# Altium project HighVoltageProbe_v1.0.PrjPcb
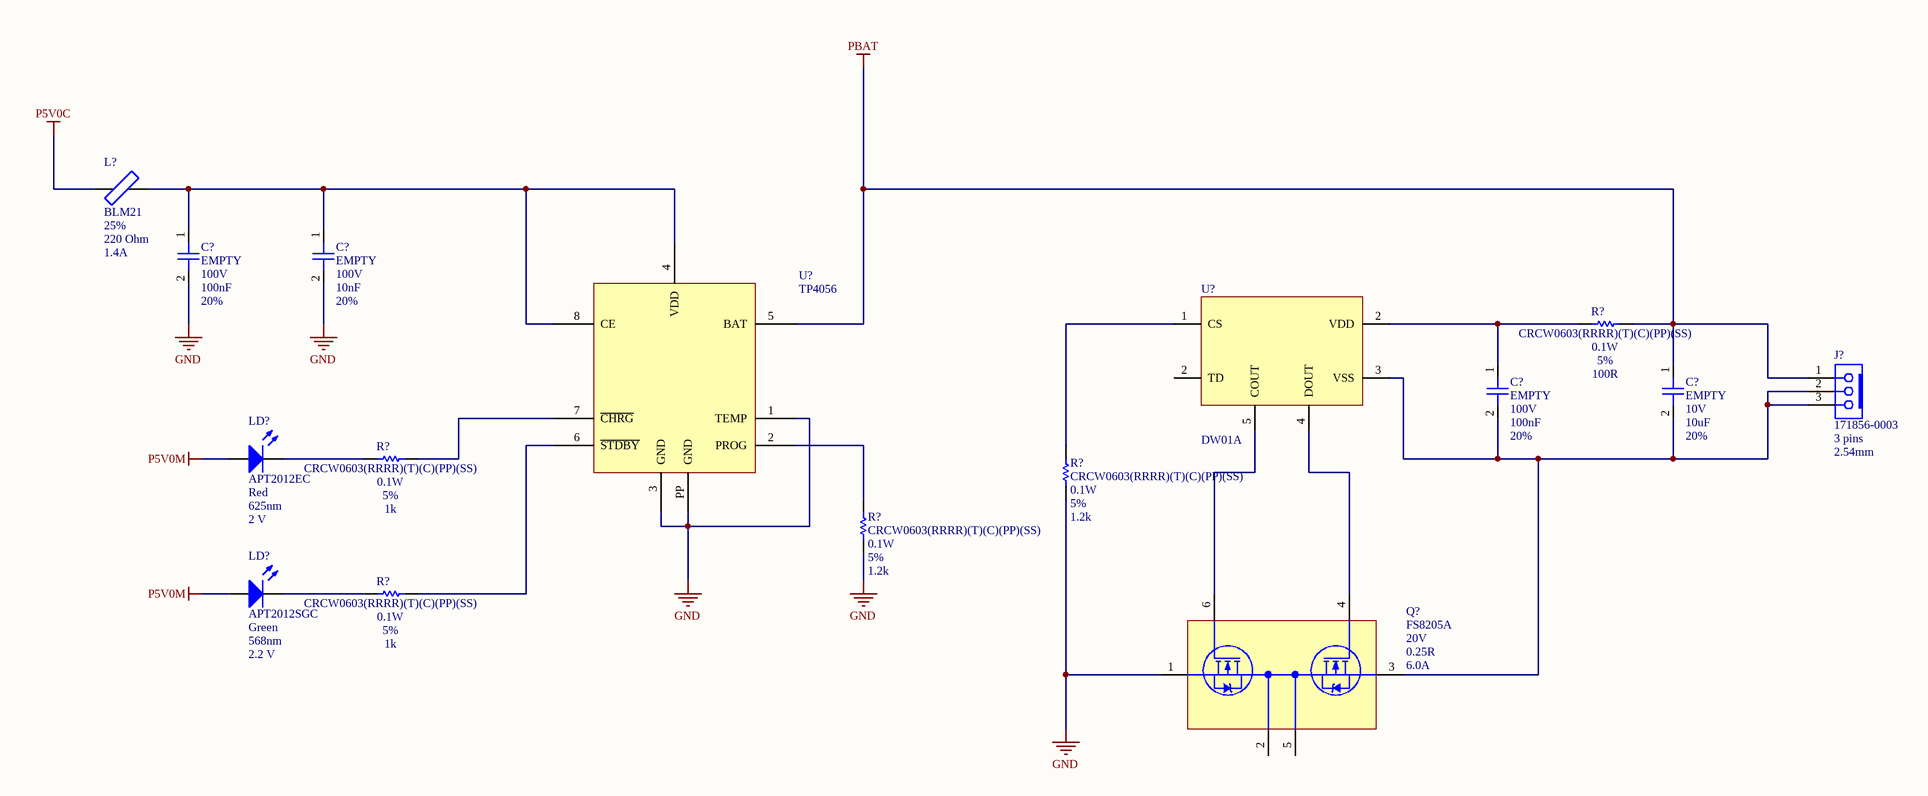
[diagram p0: HVP_BatteryCharger_v1.0.SchDoc]
7 sheets, 154 parts. Net scope: global (net labels, ports and power ports of the same name join across sheets).
Board file: HVP_PCB_v1.0.PcbDoc
Sheets:
  HVP_Title_v1.0.SchDoc
  HVP_BatteryCharger_v1.0.SchDoc
  HVP_PowerSupply_v1.0.SchDoc
  HVP_PowerSupplyOpAmp_v1.0.SchDoc
  HVP_InputDivisor_v1.0.SchDoc
  HVP_Amplifier_v1.0.SchDoc
  HVP_DiffAmplifier_v1.0.SchDoc

## Sheet HVP_Title_v1.0.SchDoc
size A3; Organization: SEW EURODRIVE; Address1: Jose Rubim Rd.; Address2: Santos Dumont Rd.; Address3: 205; Address4: Indaiatuba/SP; Revision: 0.0; Address5: Brazil

### Notes on the sheet
- Rev.
- Description
- Date
- Author
- Page
- Schematic Page
- 1.0
- Project kickoff
- 1
- Title page
- Title
- Checked By
- Size:
- Revision:
- A3
- Date:
- Project
- Time:
- Sheet
- of
- File:

## Sheet HVP_BatteryCharger_v1.0.SchDoc
size A3; Organization: SEW EURODRIVE; Address1: Jose Rubim Rd.; Address2: Santos Dumont Rd.; Address3: 205; Address4: Indaiatuba/SP; Address5: Brazil

### Parts
(Parts that share a designator on the sheet are numbered #1, #2 ... from top to bottom, then left to right.)
C?#1  value 100nF  PartNumber1: EMPTY  Voltage: 100V  Tolerance: 20%  [CAP0603]  (hidden comment: CC0603)
C?#2  value 10nF  PartNumber1: EMPTY  Voltage: 100V  Tolerance: 20%  [CAP0603]  (hidden comment: CC0603)
C?#3  value 100nF  PartNumber1: EMPTY  Voltage: 100V  Tolerance: 20%  [CAP0603]  (hidden comment: CC0603)
C?#4  value 10uF  PartNumber1: EMPTY  Voltage: 10V  Tolerance: 20%  [CAP0805]  (hidden comment: CC0805)
J?#1  Pins: 3 pins  Pitch: 2.54mm  [CONKK03STRMALE_100_100]  (hidden comment: 171856-0003)
L?#1  value 220 Ohm  Tolerance: 25%  Current: 1.4A  [IND0805]  (hidden comment: BLM21)
LD?#1  Colour: Red  Wavelength: 625nm  Vled: 2 V  [LED0805]  (hidden comment: APT2012EC)
LD?#2  Colour: Green  Wavelength: 568nm  Vled: 2.2 V  [LED0805]  (hidden comment: APT2012SGC)
Q?  Vdds: 20V  Rds(on): 0.25R  Id: 6.0A  [TSOT23-6]  (hidden comment: FS8205A)
R?#1  value 100R  PartNumber1: CRCW0603(RRRR)(T)(C)(PP)(SS)  Power: 0.1W  Tolerance: 5%  [RES0603]  (hidden comment: Chip Resistor)
R?#2  value 1k  PartNumber1: CRCW0603(RRRR)(T)(C)(PP)(SS)  Power: 0.1W  Tolerance: 5%  [RES0603]  (hidden comment: Chip Resistor)
R?#3  value 1.2k  PartNumber1: CRCW0603(RRRR)(T)(C)(PP)(SS)  Power: 0.1W  Tolerance: 5%  [RES0603]  (hidden comment: Chip Resistor)
R?#4  value 1.2k  PartNumber1: CRCW0603(RRRR)(T)(C)(PP)(SS)  Power: 0.1W  Tolerance: 5%  [RES0603]  (hidden comment: Chip Resistor)
R?#5  value 1k  PartNumber1: CRCW0603(RRRR)(T)(C)(PP)(SS)  Power: 0.1W  Tolerance: 5%  [RES0603]  (hidden comment: Chip Resistor)
U?#1  DW01A  [SOT23-6]
U?#2  TP4056  [SOIC-8P-3.9mm]

### Nets
GND: C?#1.2 C?#2.2 Q?.1(S1) R?#3.1 R?#4.1 U?#2.1(TEMP) U?#2.3(GND) U?#2.PP(GND)
P5V0C: L?#1.1
P5V0M: LD?#1.A LD?#2.A
PBAT: C?#4.1 J?#1.1 R?#1.1 U?#2.5(BAT)
NetC?#1_1: C?#1.1 C?#2.1 L?#1.2 U?#2.4(VDD) U?#2.8(CE)
NetC?#3_1: C?#3.1 R?#1.2 U?#1.2(VDD)
NetC?#3_2: C?#3.2 C?#4.2 J?#1.2 J?#1.3 Q?.3(S2) U?#1.3(VSS)
NetLD?#1_K: LD?#1.K R?#2.1
NetLD?#2_K: LD?#2.K R?#5.1
NetQ?_4: Q?.4(G2) U?#1.4(DOUT)
NetQ?_6: Q?.6(G1) U?#1.5(COUT)
NetR?#2_2: R?#2.2 U?#2.7(~{CHRG})
NetR?#3_2: R?#3.2 U?#1.1(CS)
NetR?#4_2: R?#4.2 U?#2.2(PROG)
NetR?#5_2: R?#5.2 U?#2.6(~{STDBY})

Not connected (* = marked no-connect by the designer): Q? 2(D1/D2) 5(D1/D2)

### Notes on the sheet
- Title
- Author
- Checked By
- Size:
- Revision:
- A3
- Date:
- Project
- Time:
- Sheet
- of
- File:

### Library data of the parts
C?#1-C?#3 = CC0603: Surface Mount Multilayer Ceramic Chip Capacitors  for Commercial Applications; Manufacter1: Yageo; Published: 19-Jun-2016; LatestRevisionDate: 19-Jun-2016; Publisher: Lucas Moraes; PackageReference: CAP0603; PackageDescription: CAP0603;2 Leads
C?#4 = CC0805: Surface Mount Multilayer Ceramic Chip Capacitors  for Commercial Applications; Manufacter1: Yageo; Published: 19-Jun-2016; LatestRevisionDate: 19-Jun-2016; Publisher: Lucas Moraes; PackageReference: CAP0805; PackageDescription: CAP0805;2 Leads
J?#1 = 171856-0003: Headers & Wire Housings KK RPC 100 Hdr FrLk Vert 03; Manufacter1: Molex; LastRevisionNote: Created; Gender: Male; Direction: 180; Published: 20-Dec-2022; LatestRevisionDate: 20-Dec-2022; PackageReference: CONKK03STRMALE_100_100; Publisher: Lucas Moraes; PackageDescription: CONKK03STRMALE_100_100; 3 Leads; Type: Pin; Datasheet: https://www.molex.com/pdm_docs/sd/1718563003_sd.pdf; PartNumber1: 171856-0003
L?#1 = BLM21: Ferrite Beads 0805; Manufacter1: Murata Electronics; LatestRevisionDate: 05-Apr-2023; PackageReference: IND0805; Publisher: Lucas Moraes; PackageDescription: IND0805; 2 Leads; Published: 05-Apr-2023; Datasheet: https://br.mouser.com/datasheet/2/281/ENFA0005-1915781.pdf; Code: *; PartNumber1: BLM21
LD?#1 = APT2012EC: Standard LEDs - SMD 0805 Red; Manufacter1: Kingbright; LastRevisionNote: Created; Published: 29-Dec-2016; PackageReference: LED0805; Publisher: Lucas Moraes; PackageDescription: LED0805; 2 leads; LastRevision: 29-Dec-2016; Datasheet: http://www.us.kingbright.com/images/catalog/SPEC/APT2012EC.pdf; PartNumber1: APT2012EC
LD?#2 = APT2012SGC: Standard LEDs - SMD 0805 Green; Manufacter1: Kingbright; LastRevisionNote: Created; Published: 29-Dec-2016; PackageReference: LED0805; Publisher: Lucas Moraes; PackageDescription: LED0805; 2 leads; LastRevision: 29-Dec-2016; Datasheet: http://www.us.kingbright.com/images/catalog/SPEC/APT2012SGC.pdf; PartNumber1: APT2012SGC
Q? = FS8205A: MOSFET DUAL N-CHANNEL; Manufacter1: Diodes Incorporated; Published: 21-Mar-2023; LatestRevisionDate: 21-Mar-2023; LatestRevisionNote: Created; Publisher: Lucas Moraes; PackageDescription: TSOT23-6; 6 Leads; PackageReference: TSOT23-6; PartNumber1: FS8205A
R?#1-R?#5 = CRCW0603: Thick Film Chip Resistors with CECC Approval,  available with Established Reliability; Manufacter1: Vishay; LatestRevisionDate: 06-May-2016; PackageReference: 0603; Publisher: Lucas Moraes; PackageDescription: SMD 0603; 2 Leads; Published: 06-May-2016
U?#1 = DW01A: Battery Protection IC SOT-23-6; Manufacter1: H&M semi; Published: 20-Jul-2022; LatestRevisionDate: 20-Jul-2022; LatestRevisionNote: Created; PackageReference: SOT-26; Publisher: Lucas Moraes; PackageDescription: SOT-26;6 Leads; Datasheet: https://hmsemi.com/downfile/DW01A.PDF; PartNumber1: DW01A
U?#2 = TP4056: 1A Standalone Linear Li-lon Battery Charger with Thermal Regulation in SOP-8; Manufacter1: NanJing Top Power ASIC Corp; Published: 20-Jul-2022; LatestRevisionDate: 20-Jul-2022; LatestRevisionNote: Created; PackageReference: SOIC-8-3.9mm; Publisher: Lucas Moraes; PackageDescription: SOIC-8-3.9mm;8 Leads; PartNumber1: TP4056

## Sheet HVP_PowerSupply_v1.0.SchDoc
size A3; Organization: SEW EURODRIVE; Address1: Jose Rubim Rd.; Address2: Santos Dumont Rd.; Address3: 205; Address4: Indaiatuba/SP; Address5: Brazil
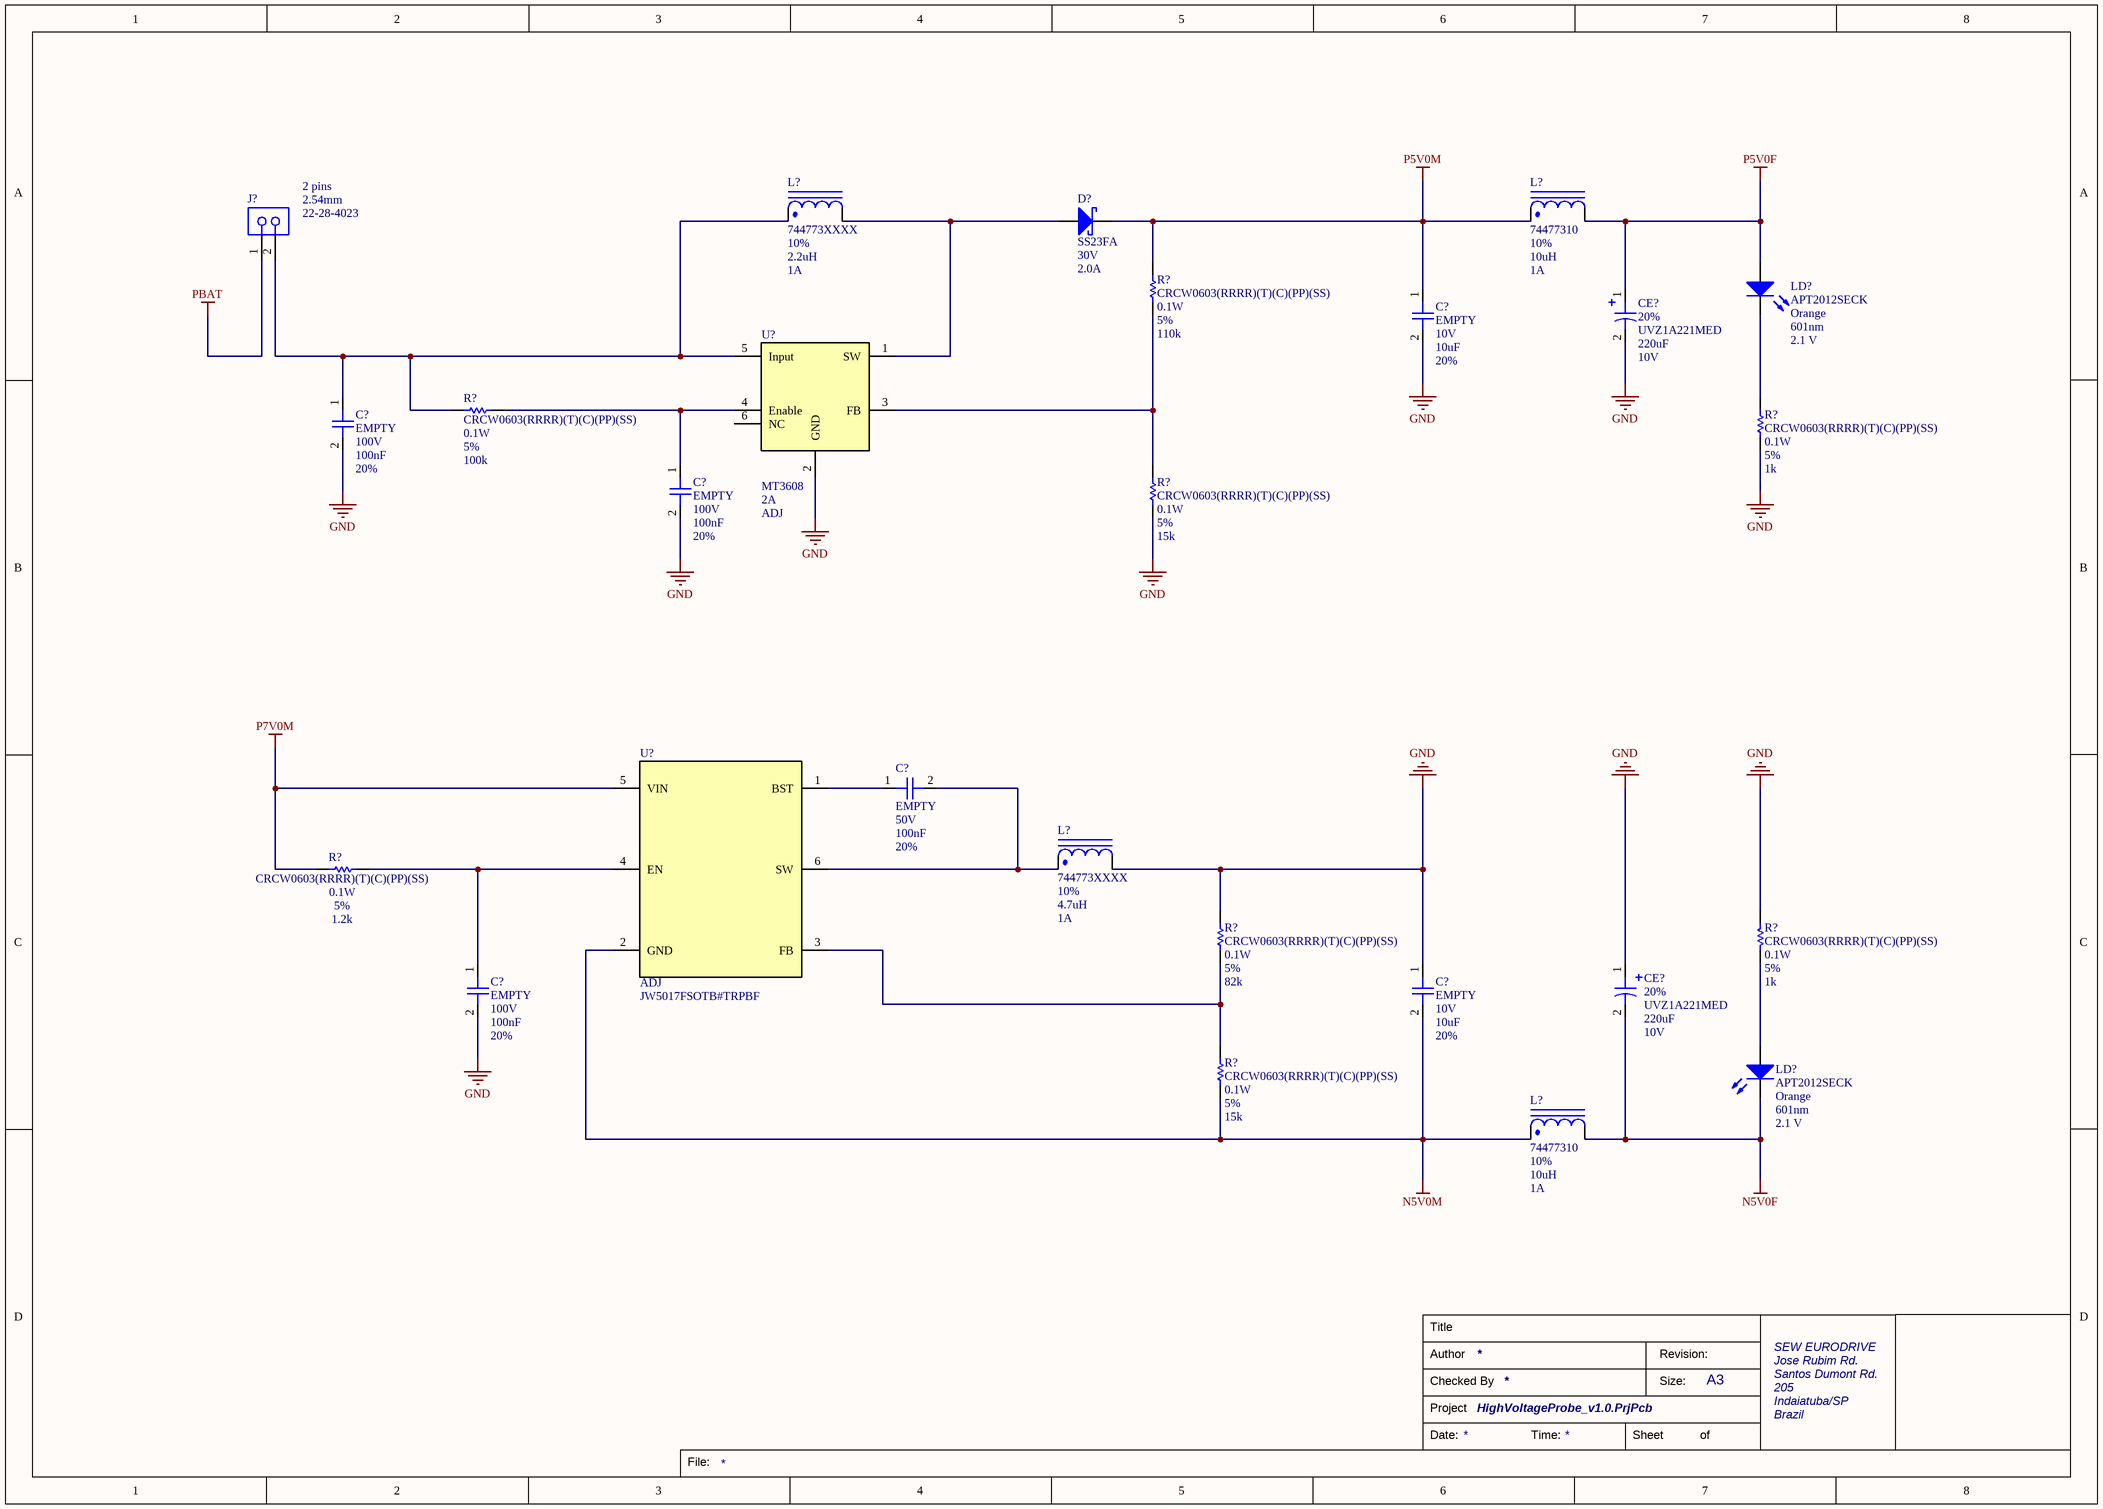
[diagram p1: HVP_PowerSupply_v1.0.SchDoc]

### Parts
(Parts that share a designator on the sheet are numbered #1, #2 ... from top to bottom, then left to right.)
C?#5  value 10uF  PartNumber1: EMPTY  Voltage: 10V  Tolerance: 20%  [CAP0805]  (hidden comment: CC0805)
C?#6  value 100nF  PartNumber1: EMPTY  Voltage: 100V  Tolerance: 20%  [CAP0603]  (hidden comment: CC0603)
C?#7  value 100nF  PartNumber1: EMPTY  Voltage: 100V  Tolerance: 20%  [CAP0603]  (hidden comment: CC0603)
C?#8  value 100nF  PartNumber1: EMPTY  Voltage: 50V  Tolerance: 20%  [CAP0603]  (hidden comment: CC0603)
C?#9  value 100nF  PartNumber1: EMPTY  Voltage: 100V  Tolerance: 20%  [CAP0603]  (hidden comment: CC0603)
C?#10  value 10uF  PartNumber1: EMPTY  Voltage: 10V  Tolerance: 20%  [CAP0805]  (hidden comment: CC0805)
CE?#1  value 220uF  Tolerance: 20%  PartNumber1: UVZ1A221MED  Voltage: 10V  [2.5-6.3-11.0]  (hidden comment: 10V 220uF)
CE?#2  value 220uF  Tolerance: 20%  PartNumber1: UVZ1A221MED  Voltage: 10V  [2.5-6.3-11.0]  (hidden comment: 10V 220uF)
D?#1  Vrrm: 30V  If: 2.0A  [SOD-123FA]  (hidden comment: SS23FA)
J?#2  Pins: 2 pins  Pitch: 2.54mm  [CONSIL02STRMALE_100_100]  (hidden comment: 22-28-4023)
L?#2  value 2.2uH  PartNumber1: 744773XXXX  Tolerance: 10%  Current: 1A  [WE-PD2-4532]  (hidden comment: WE-PD2 4532)
L?#3  value 10uH  PartNumber1: 74477310  Tolerance: 10%  Current: 1A  [WE-PD2-4532]  (hidden comment: WE-PD2 4532)
L?#4  value 4.7uH  PartNumber1: 744773XXXX  Tolerance: 10%  Current: 1A  [WE-PD2-4532]  (hidden comment: WE-PD2 4532)
L?#5  value 10uH  PartNumber1: 74477310  Tolerance: 10%  Current: 1A  [WE-PD2-4532]  (hidden comment: WE-PD2 4532)
LD?#3  Colour: Orange  Wavelength: 601nm  Vled: 2.1 V  [LED0805]  (hidden comment: APT2012SECK)
LD?#4  Colour: Orange  Wavelength: 601nm  Vled: 2.1 V  [LED0805]  (hidden comment: APT2012SECK)
R?#6  value 110k  PartNumber1: CRCW0603(RRRR)(T)(C)(PP)(SS)  Power: 0.1W  Tolerance: 5%  [RES0603]  (hidden comment: Chip Resistor)
R?#7  value 100k  PartNumber1: CRCW0603(RRRR)(T)(C)(PP)(SS)  Power: 0.1W  Tolerance: 5%  [RES0603]  (hidden comment: Chip Resistor)
R?#8  value 1k  PartNumber1: CRCW0603(RRRR)(T)(C)(PP)(SS)  Power: 0.1W  Tolerance: 5%  [RES0603]  (hidden comment: Chip Resistor)
R?#9  value 15k  PartNumber1: CRCW0603(RRRR)(T)(C)(PP)(SS)  Power: 0.1W  Tolerance: 5%  [RES0603]  (hidden comment: Chip Resistor)
R?#10  value 1.2k  PartNumber1: CRCW0603(RRRR)(T)(C)(PP)(SS)  Power: 0.1W  Tolerance: 5%  [RES0603]  (hidden comment: Chip Resistor)
R?#11  value 82k  PartNumber1: CRCW0603(RRRR)(T)(C)(PP)(SS)  Power: 0.1W  Tolerance: 5%  [RES0603]  (hidden comment: Chip Resistor)
R?#12  value 1k  PartNumber1: CRCW0603(RRRR)(T)(C)(PP)(SS)  Power: 0.1W  Tolerance: 5%  [RES0603]  (hidden comment: Chip Resistor)
R?#13  value 15k  PartNumber1: CRCW0603(RRRR)(T)(C)(PP)(SS)  Power: 0.1W  Tolerance: 5%  [RES0603]  (hidden comment: Chip Resistor)
U?#3  Current: 2A  Voltage: ADJ  [SOT23-6]  (hidden comment: MT3608)
U?#4  Voltage: ADJ  PartNumber1: JW5017FSOTB#TRPBF  [SOT23-6]  (hidden comment: JW5017F)

### Nets
GND: C?#5.2 C?#6.2 C?#7.2 C?#9.2 C?#10.1 CE?#1.2 CE?#2.1 L?#4.2 R?#8.2 R?#9.1 R?#11.2 R?#12.2 U?#3.2(GND)
N5V0F: CE?#2.2 L?#5.2 LD?#4.K
N5V0M: C?#10.2 L?#5.1 R?#13.1 U?#4.2(GND)
P5V0F: CE?#1.1 L?#3.2 LD?#3.A
P5V0M: C?#5.1 D?#1.K L?#3.1 R?#6.2
P7V0M: R?#10.2 U?#4.5(VIN)
PBAT: J?#2.1
NetC?#6_1: C?#6.1 J?#2.2 L?#2.1 R?#7.2 U?#3.5(Input)
NetC?#7_1: C?#7.1 R?#7.1 U?#3.4(Enable)
NetC?#8_1: C?#8.1 U?#4.1(BST)
NetC?#8_2: C?#8.2 L?#4.1 U?#4.6(SW)
NetC?#9_1: C?#9.1 R?#10.1 U?#4.4(EN)
NetD?#1_A: D?#1.A L?#2.2 U?#3.1(SW)
NetLD?#3_K: LD?#3.K R?#8.1
NetLD?#4_A: LD?#4.A R?#12.1
NetR?#6_1: R?#6.1 R?#9.2 U?#3.3(FB)
NetR?#11_1: R?#11.1 R?#13.2 U?#4.3(FB)

Not connected (* = marked no-connect by the designer): U?#3 6(NC)

### Notes on the sheet
- Title
- Author
- Checked By
- Size:
- Revision:
- A3
- Date:
- Project
- Time:
- Sheet
- of
- File:

### Library data of the parts
C?#5 C?#10 = CC0805: as C?#4 on sheet HVP_BatteryCharger_v1.0; Published: 19-Jun-2016; LatestRevisionDate: 19-Jun-2016; Publisher: Lucas Moraes; PackageReference: CAP0805; PackageDescription: CAP0805;2 Leads
C?#6-C?#9 = CC0603: as C?#1 on sheet HVP_BatteryCharger_v1.0; Published: 19-Jun-2016; LatestRevisionDate: 19-Jun-2016; Publisher: Lucas Moraes; PackageReference: CAP0603; PackageDescription: CAP0603;2 Leads
CE?#1 CE?#2 = 10V 220uF: Electrolytic Capacitor PTH; Manufacter1: Nichicon; Code: 221; Published: 26-Dec-2016; LatestRevisionDate: 26-Dec-2016; PackageReference: 2.5-6.3; Publisher: Lucas Moraes; PackageDescription: 2.5-6.3;2 leads; LatestRevisionNote: Created
D?#1 = SS23FA: HIGH EFFICIENCY FAST RECOVERY RECTIFIER DIODE; Manufacter1: Fairchild; Vf: 0.50V; Published: 29-Jun-2016; LatestRevisionDate: 29-Jun-2016; PackageReference: SOD-123FA; Publisher: Lucas Moraes; PackageDescription: SOD-123FA; 2 Leads; PartNumber1: SS23FA
J?#2 = 22-28-4023: Headers & Wire Housings 02 MODII HDR SRST B/A .100CL; Manufacter1: Molex; LastRevisionNote: Created; Gender: Male; Published: 15-Set-2017; LatestRevisionDate: 27-Mar-2023; PackageReference: CONSIL02STRMALE_100_100; Publisher: Lucas Moraes; PackageDescription: CONSIL02STRMALE_100_100; 2 Leads; Type: Pin; PartNumber1: 22-28-4023
L?#2-L?#5 = WE-PD2 4532: Fixed Inductors WE-PD2 4532; Manufacter1: Wurth Elektronik; LatestRevisionDate: 22-Mar-2022; PackageReference: WE-PD2 4532; Publisher: Lucas Moraes; PackageDescription: WE-PD2 4532; 2 Leads; Published: 22-Mar-2022; Datasheet: https://www.we-online.com/catalog/en/WE-PD2
LD?#3 LD?#4 = APT2012SECK: Standard LEDs - SMD 0805 Orange; Manufacter1: Kingbright; LastRevisionNote: Created; Published: 29-Dec-2016; PackageReference: LED0805; Publisher: Lucas Moraes; PackageDescription: LED0805; 2 leads; LastRevision: 29-Dec-2016; Datasheet: http://www.mouser.com/ds/2/216/APT2012SECK-230997.pdf; PartNumber1: APT2012SECK
R?#6-R?#13 = CRCW0603: as R?#1 on sheet HVP_BatteryCharger_v1.0; LatestRevisionDate: 06-May-2016; PackageReference: 0603; Publisher: Lucas Moraes; PackageDescription: SMD 0603; 2 Leads; Published: 06-May-2016
U?#3 = MT3608: High Efficiency 1.2MHz 2A Step Up Converter; Manufacter1: AEROSEMI; Published: 22-Dec-2019; LatestRevisionDate: 22-Dec-2019; LatestRevisionNote: Created; PackageReference: SOT-23-6; Publisher: Lucas Moraes; PackageDescription: SOT-23-6;6 Leads; PartNumber2: *; Manufacter2: *; Manufacter3: *; PartNumber3: *; PartNumber1: MT3608
U?#4 = JW5017F: 1.2A, 26V Synchronous Step-Down Converter; Manufacter1: JOULWATT; Current: 1.2A; LatestRevisionDate: 08-Jan-2022; LatestRevisionNote: Created; PackageDescription: SOT-23-6;6 Leads; PackageReference: SOT-23-6; Published: 08-Jan-2022; Publisher: Lucas Moraes

## Sheet HVP_PowerSupplyOpAmp_v1.0.SchDoc
size A3; Organization: SEW EURODRIVE; Address1: Jose Rubim Rd.; Address2: Santos Dumont Rd.; Address3: 205; Address4: Indaiatuba/SP; Address5: Brazil
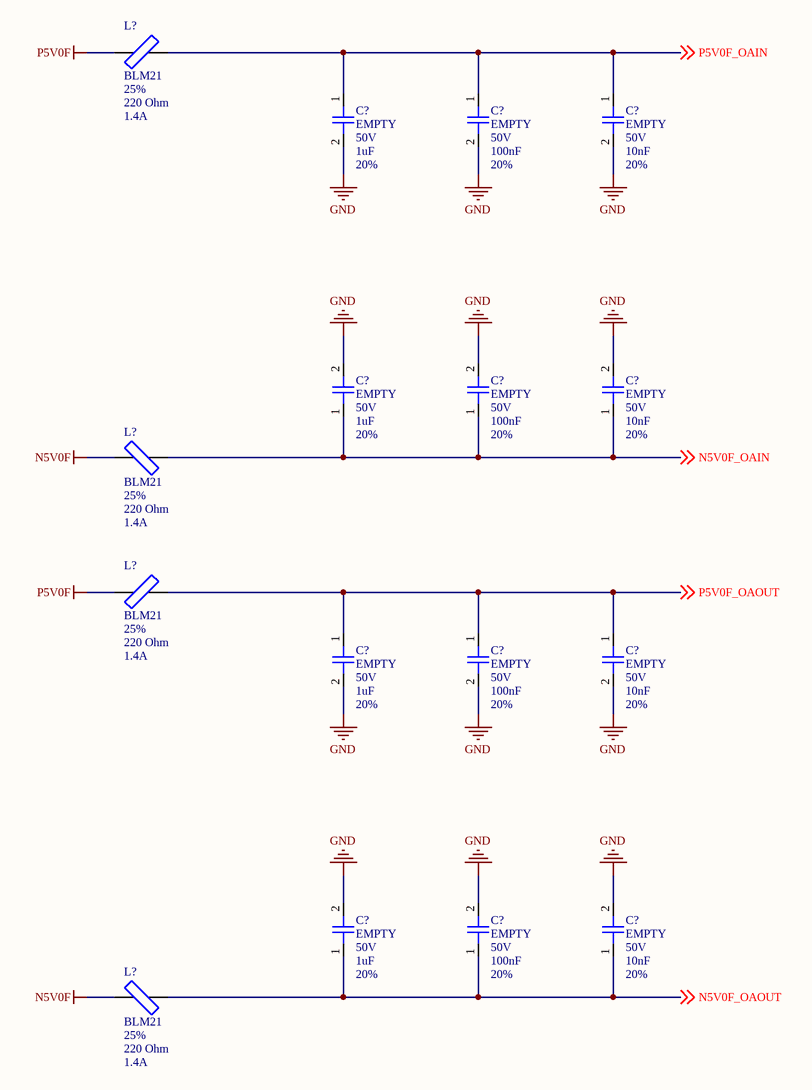
[diagram p2: HVP_PowerSupplyOpAmp_v1.0.SchDoc]

### Parts
(Parts that share a designator on the sheet are numbered #1, #2 ... from top to bottom, then left to right.)
C?#11  value 1uF  PartNumber1: EMPTY  Voltage: 50V  Tolerance: 20%  [CAP0603]  (hidden comment: CC0603)
C?#12  value 100nF  PartNumber1: EMPTY  Voltage: 50V  Tolerance: 20%  [CAP0603]  (hidden comment: CC0603)
C?#13  value 10nF  PartNumber1: EMPTY  Voltage: 50V  Tolerance: 20%  [CAP0603]  (hidden comment: CC0603)
C?#14  value 1uF  PartNumber1: EMPTY  Voltage: 50V  Tolerance: 20%  [CAP0603]  (hidden comment: CC0603)
C?#15  value 100nF  PartNumber1: EMPTY  Voltage: 50V  Tolerance: 20%  [CAP0603]  (hidden comment: CC0603)
C?#16  value 10nF  PartNumber1: EMPTY  Voltage: 50V  Tolerance: 20%  [CAP0603]  (hidden comment: CC0603)
C?#17  value 1uF  PartNumber1: EMPTY  Voltage: 50V  Tolerance: 20%  [CAP0603]  (hidden comment: CC0603)
C?#18  value 100nF  PartNumber1: EMPTY  Voltage: 50V  Tolerance: 20%  [CAP0603]  (hidden comment: CC0603)
C?#19  value 10nF  PartNumber1: EMPTY  Voltage: 50V  Tolerance: 20%  [CAP0603]  (hidden comment: CC0603)
C?#20  value 1uF  PartNumber1: EMPTY  Voltage: 50V  Tolerance: 20%  [CAP0603]  (hidden comment: CC0603)
C?#21  value 100nF  PartNumber1: EMPTY  Voltage: 50V  Tolerance: 20%  [CAP0603]  (hidden comment: CC0603)
C?#22  value 10nF  PartNumber1: EMPTY  Voltage: 50V  Tolerance: 20%  [CAP0603]  (hidden comment: CC0603)
L?#6  value 220 Ohm  Tolerance: 25%  Current: 1.4A  [IND0805]  (hidden comment: BLM21)
L?#7  value 220 Ohm  Tolerance: 25%  Current: 1.4A  [IND0805]  (hidden comment: BLM21)
L?#8  value 220 Ohm  Tolerance: 25%  Current: 1.4A  [IND0805]  (hidden comment: BLM21)
L?#9  value 220 Ohm  Tolerance: 25%  Current: 1.4A  [IND0805]  (hidden comment: BLM21)

### Nets
GND: C?#11.2 C?#12.2 C?#13.2 C?#14.2 C?#15.2 C?#16.2 C?#17.2 C?#18.2 C?#19.2 C?#20.2 C?#21.2 C?#22.2
N5V0F: L?#7.1 L?#9.1
P5V0F: L?#6.1 L?#8.1
N5V0F_OAIN: C?#14.1 C?#15.1 C?#16.1 L?#7.2 ; off-sheet N5V0F_OAIN
N5V0F_OAOUT: C?#20.1 C?#21.1 C?#22.1 L?#9.2 ; off-sheet N5V0F_OAOUT
P5V0F_OAIN: C?#11.1 C?#12.1 C?#13.1 L?#6.2 ; off-sheet P5V0F_OAIN
P5V0F_OAOUT: C?#17.1 C?#18.1 C?#19.1 L?#8.2 ; off-sheet P5V0F_OAOUT

### Notes on the sheet
- Title
- Author
- Checked By
- Size:
- Revision:
- A3
- Date:
- Project
- Time:
- Sheet
- of
- File:

### Library data of the parts
C?#11-C?#22 = CC0603: as C?#1 on sheet HVP_BatteryCharger_v1.0; Published: 19-Jun-2016; LatestRevisionDate: 19-Jun-2016; Publisher: Lucas Moraes; PackageReference: CAP0603; PackageDescription: CAP0603;2 Leads
L?#6-L?#9 = BLM21: as L?#1 on sheet HVP_BatteryCharger_v1.0; LatestRevisionDate: 05-Apr-2023; PackageReference: IND0805; Publisher: Lucas Moraes; PackageDescription: IND0805; 2 Leads; Published: 05-Apr-2023; Datasheet: https://br.mouser.com/datasheet/2/281/ENFA0005-1915781.pdf; Code: *; PartNumber1: BLM21

## Sheet HVP_InputDivisor_v1.0.SchDoc
size A3; Organization: SEW EURODRIVE; Address1: Jose Rubim Rd.; Address2: Santos Dumont Rd.; Address3: 205; Address4: Indaiatuba/SP; Address5: Brazil
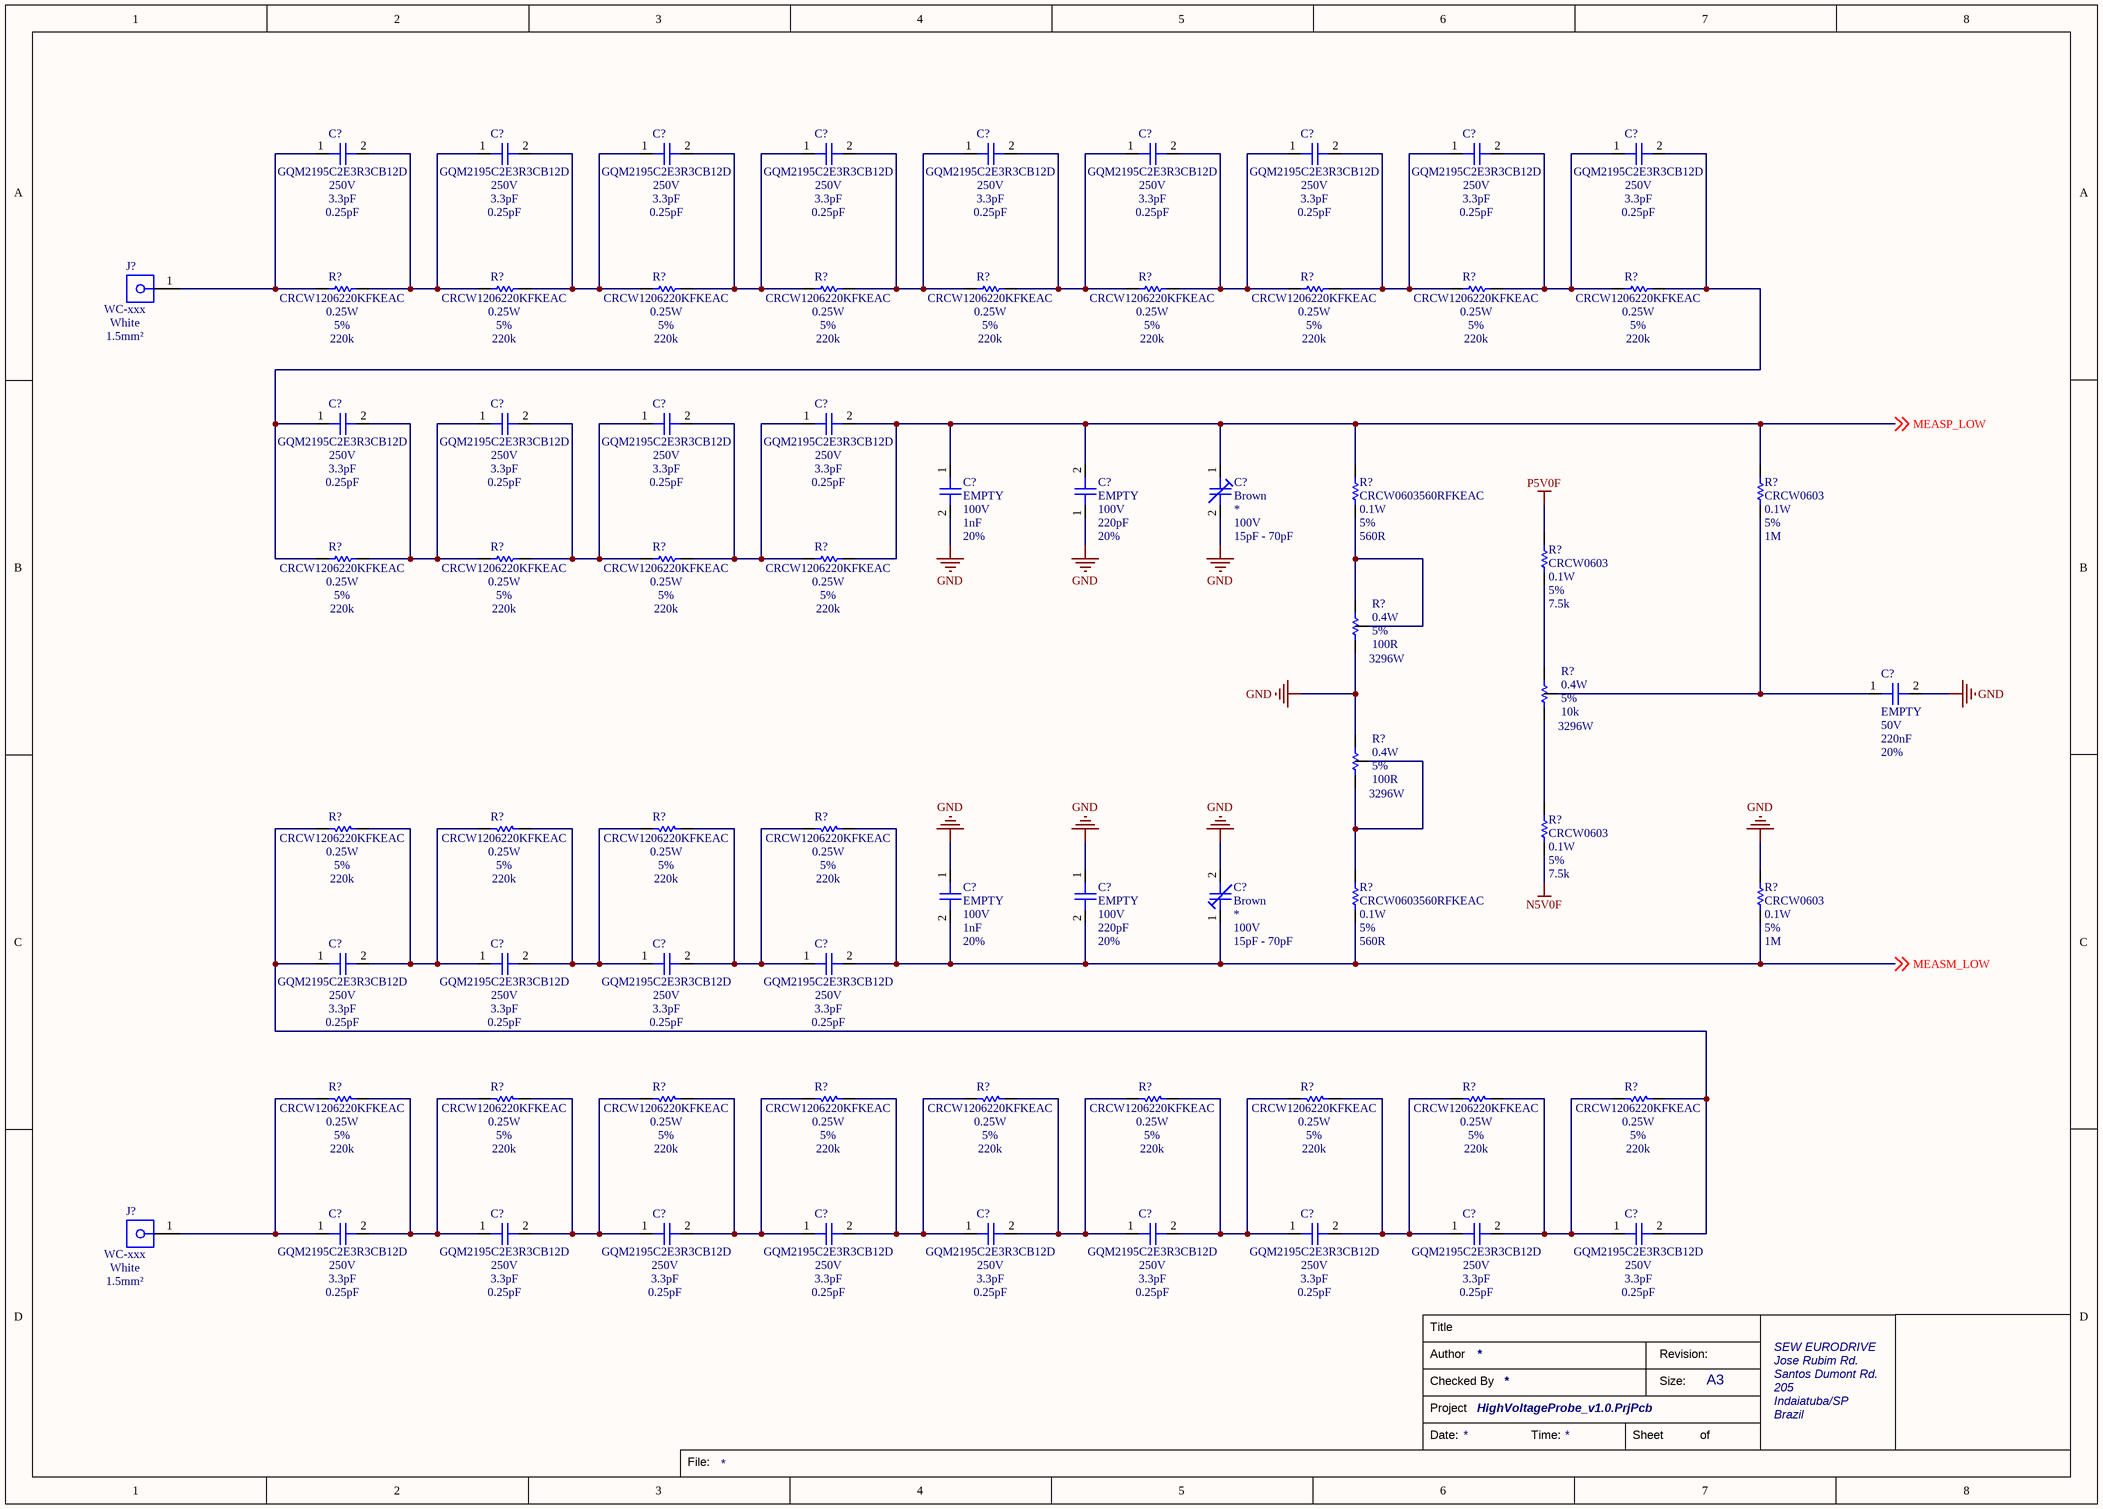
[diagram p3: HVP_InputDivisor_v1.0.SchDoc]

### Parts
(Parts that share a designator on the sheet are numbered #1, #2 ... from top to bottom, then left to right.)
C?#23  value 3.3pF  PartNumber1: GQM2195C2E3R3CB12D  Voltage: 250V  Tolerance: 0.25pF  [CAP0805]  (hidden comment: CC0805)
C?#24  value 3.3pF  PartNumber1: GQM2195C2E3R3CB12D  Voltage: 250V  Tolerance: 0.25pF  [CAP0805]  (hidden comment: CC0805)
C?#25  value 3.3pF  PartNumber1: GQM2195C2E3R3CB12D  Voltage: 250V  Tolerance: 0.25pF  [CAP0805]  (hidden comment: CC0805)
C?#26  value 3.3pF  PartNumber1: GQM2195C2E3R3CB12D  Voltage: 250V  Tolerance: 0.25pF  [CAP0805]  (hidden comment: CC0805)
C?#27  value 3.3pF  PartNumber1: GQM2195C2E3R3CB12D  Voltage: 250V  Tolerance: 0.25pF  [CAP0805]  (hidden comment: CC0805)
C?#28  value 3.3pF  PartNumber1: GQM2195C2E3R3CB12D  Voltage: 250V  Tolerance: 0.25pF  [CAP0805]  (hidden comment: CC0805)
C?#29  value 3.3pF  PartNumber1: GQM2195C2E3R3CB12D  Voltage: 250V  Tolerance: 0.25pF  [CAP0805]  (hidden comment: CC0805)
C?#30  value 3.3pF  PartNumber1: GQM2195C2E3R3CB12D  Voltage: 250V  Tolerance: 0.25pF  [CAP0805]  (hidden comment: CC0805)
C?#31  value 3.3pF  PartNumber1: GQM2195C2E3R3CB12D  Voltage: 250V  Tolerance: 0.25pF  [CAP0805]  (hidden comment: CC0805)
C?#32  value 3.3pF  PartNumber1: GQM2195C2E3R3CB12D  Voltage: 250V  Tolerance: 0.25pF  [CAP0805]  (hidden comment: CC0805)
C?#33  value 3.3pF  PartNumber1: GQM2195C2E3R3CB12D  Voltage: 250V  Tolerance: 0.25pF  [CAP0805]  (hidden comment: CC0805)
C?#34  value 3.3pF  PartNumber1: GQM2195C2E3R3CB12D  Voltage: 250V  Tolerance: 0.25pF  [CAP0805]  (hidden comment: CC0805)
C?#35  value 3.3pF  PartNumber1: GQM2195C2E3R3CB12D  Voltage: 250V  Tolerance: 0.25pF  [CAP0805]  (hidden comment: CC0805)
C?#36  value 1nF  PartNumber1: EMPTY  Voltage: 100V  Tolerance: 20%  [CAP0603]  (hidden comment: CC0603)
C?#37  value 220pF  PartNumber1: EMPTY  Voltage: 100V  Tolerance: 20%  [CAP0603]  (hidden comment: CC0603)
C?#38  value 15pF - 70pF  Colour: Brown  Voltage: 100V  [TrimmerBrown]  (hidden comment: TrimmerBrown_70pF_100V)
C?#39  value 220nF  PartNumber1: EMPTY  Voltage: 50V  Tolerance: 20%  [CAP0603]  (hidden comment: CC0603)
C?#40  value 1nF  PartNumber1: EMPTY  Voltage: 100V  Tolerance: 20%  [CAP0603]  (hidden comment: CC0603)
C?#41  value 220pF  PartNumber1: EMPTY  Voltage: 100V  Tolerance: 20%  [CAP0603]  (hidden comment: CC0603)
C?#42  value 15pF - 70pF  Colour: Brown  Voltage: 100V  [TrimmerBrown]  (hidden comment: TrimmerBrown_70pF_100V)
C?#43  value 3.3pF  PartNumber1: GQM2195C2E3R3CB12D  Voltage: 250V  Tolerance: 0.25pF  [CAP0805]  (hidden comment: CC0805)
C?#44  value 3.3pF  PartNumber1: GQM2195C2E3R3CB12D  Voltage: 250V  Tolerance: 0.25pF  [CAP0805]  (hidden comment: CC0805)
C?#45  value 3.3pF  PartNumber1: GQM2195C2E3R3CB12D  Voltage: 250V  Tolerance: 0.25pF  [CAP0805]  (hidden comment: CC0805)
C?#46  value 3.3pF  PartNumber1: GQM2195C2E3R3CB12D  Voltage: 250V  Tolerance: 0.25pF  [CAP0805]  (hidden comment: CC0805)
C?#47  value 3.3pF  PartNumber1: GQM2195C2E3R3CB12D  Voltage: 250V  Tolerance: 0.25pF  [CAP0805]  (hidden comment: CC0805)
C?#48  value 3.3pF  PartNumber1: GQM2195C2E3R3CB12D  Voltage: 250V  Tolerance: 0.25pF  [CAP0805]  (hidden comment: CC0805)
C?#49  value 3.3pF  PartNumber1: GQM2195C2E3R3CB12D  Voltage: 250V  Tolerance: 0.25pF  [CAP0805]  (hidden comment: CC0805)
C?#50  value 3.3pF  PartNumber1: GQM2195C2E3R3CB12D  Voltage: 250V  Tolerance: 0.25pF  [CAP0805]  (hidden comment: CC0805)
C?#51  value 3.3pF  PartNumber1: GQM2195C2E3R3CB12D  Voltage: 250V  Tolerance: 0.25pF  [CAP0805]  (hidden comment: CC0805)
C?#52  value 3.3pF  PartNumber1: GQM2195C2E3R3CB12D  Voltage: 250V  Tolerance: 0.25pF  [CAP0805]  (hidden comment: CC0805)
C?#53  value 3.3pF  PartNumber1: GQM2195C2E3R3CB12D  Voltage: 250V  Tolerance: 0.25pF  [CAP0805]  (hidden comment: CC0805)
C?#54  value 3.3pF  PartNumber1: GQM2195C2E3R3CB12D  Voltage: 250V  Tolerance: 0.25pF  [CAP0805]  (hidden comment: CC0805)
C?#55  value 3.3pF  PartNumber1: GQM2195C2E3R3CB12D  Voltage: 250V  Tolerance: 0.25pF  [CAP0805]  (hidden comment: CC0805)
J?#3  WireCode: WC-xxx  WireColour: White  WireSize: 1.5mm²  [WireConnector1.5mm2]  (hidden comment: Wire Connector 1.5mm2)
J?#4  WireCode: WC-xxx  WireColour: White  WireSize: 1.5mm²  [WireConnector1.5mm2]  (hidden comment: Wire Connector 1.5mm2)
R?#14  value 220k  PartNumber1: CRCW1206220KFKEAC  Power: 0.25W  Tolerance: 5%  [RES1206]  (hidden comment: Chip Resistor)
R?#15  value 220k  PartNumber1: CRCW1206220KFKEAC  Power: 0.25W  Tolerance: 5%  [RES1206]  (hidden comment: Chip Resistor)
R?#16  value 220k  PartNumber1: CRCW1206220KFKEAC  Power: 0.25W  Tolerance: 5%  [RES1206]  (hidden comment: Chip Resistor)
R?#17  value 220k  PartNumber1: CRCW1206220KFKEAC  Power: 0.25W  Tolerance: 5%  [RES1206]  (hidden comment: Chip Resistor)
R?#18  value 220k  PartNumber1: CRCW1206220KFKEAC  Power: 0.25W  Tolerance: 5%  [RES1206]  (hidden comment: Chip Resistor)
R?#19  value 220k  PartNumber1: CRCW1206220KFKEAC  Power: 0.25W  Tolerance: 5%  [RES1206]  (hidden comment: Chip Resistor)
R?#20  value 220k  PartNumber1: CRCW1206220KFKEAC  Power: 0.25W  Tolerance: 5%  [RES1206]  (hidden comment: Chip Resistor)
R?#21  value 220k  PartNumber1: CRCW1206220KFKEAC  Power: 0.25W  Tolerance: 5%  [RES1206]  (hidden comment: Chip Resistor)
R?#22  value 220k  PartNumber1: CRCW1206220KFKEAC  Power: 0.25W  Tolerance: 5%  [RES1206]  (hidden comment: Chip Resistor)
R?#23  value 560R  PartNumber1: CRCW0603560RFKEAC  Power: 0.1W  Tolerance: 5%  [RES0603]  (hidden comment: Chip Resistor)
R?#24  value 1M  Power: 0.1W  Tolerance: 5%  [RES0603]  (hidden comment: Chip Resistor)
R?#25  value 220k  PartNumber1: CRCW1206220KFKEAC  Power: 0.25W  Tolerance: 5%  [RES1206]  (hidden comment: Chip Resistor)
R?#26  value 220k  PartNumber1: CRCW1206220KFKEAC  Power: 0.25W  Tolerance: 5%  [RES1206]  (hidden comment: Chip Resistor)
R?#27  value 220k  PartNumber1: CRCW1206220KFKEAC  Power: 0.25W  Tolerance: 5%  [RES1206]  (hidden comment: Chip Resistor)
R?#28  value 220k  PartNumber1: CRCW1206220KFKEAC  Power: 0.25W  Tolerance: 5%  [RES1206]  (hidden comment: Chip Resistor)
R?#29  value 7.5k  Power: 0.1W  Tolerance: 5%  [RES0603]  (hidden comment: Chip Resistor)
R?#30  value 100R  Power: 0.4W  Tolerance: 5%  [3296W]  (hidden comment: 3296W)
R?#31  value 10k  Power: 0.4W  Tolerance: 5%  [3296W]  (hidden comment: 3296W)
R?#32  value 100R  Power: 0.4W  Tolerance: 5%  [3296W]  (hidden comment: 3296W)
R?#33  value 220k  PartNumber1: CRCW1206220KFKEAC  Power: 0.25W  Tolerance: 5%  [RES1206]  (hidden comment: Chip Resistor)
R?#34  value 220k  PartNumber1: CRCW1206220KFKEAC  Power: 0.25W  Tolerance: 5%  [RES1206]  (hidden comment: Chip Resistor)
R?#35  value 220k  PartNumber1: CRCW1206220KFKEAC  Power: 0.25W  Tolerance: 5%  [RES1206]  (hidden comment: Chip Resistor)
R?#36  value 220k  PartNumber1: CRCW1206220KFKEAC  Power: 0.25W  Tolerance: 5%  [RES1206]  (hidden comment: Chip Resistor)
R?#37  value 7.5k  Power: 0.1W  Tolerance: 5%  [RES0603]  (hidden comment: Chip Resistor)
R?#38  value 560R  PartNumber1: CRCW0603560RFKEAC  Power: 0.1W  Tolerance: 5%  [RES0603]  (hidden comment: Chip Resistor)
R?#39  value 1M  Power: 0.1W  Tolerance: 5%  [RES0603]  (hidden comment: Chip Resistor)
R?#40  value 220k  PartNumber1: CRCW1206220KFKEAC  Power: 0.25W  Tolerance: 5%  [RES1206]  (hidden comment: Chip Resistor)
R?#41  value 220k  PartNumber1: CRCW1206220KFKEAC  Power: 0.25W  Tolerance: 5%  [RES1206]  (hidden comment: Chip Resistor)
R?#42  value 220k  PartNumber1: CRCW1206220KFKEAC  Power: 0.25W  Tolerance: 5%  [RES1206]  (hidden comment: Chip Resistor)
R?#43  value 220k  PartNumber1: CRCW1206220KFKEAC  Power: 0.25W  Tolerance: 5%  [RES1206]  (hidden comment: Chip Resistor)
R?#44  value 220k  PartNumber1: CRCW1206220KFKEAC  Power: 0.25W  Tolerance: 5%  [RES1206]  (hidden comment: Chip Resistor)
R?#45  value 220k  PartNumber1: CRCW1206220KFKEAC  Power: 0.25W  Tolerance: 5%  [RES1206]  (hidden comment: Chip Resistor)
R?#46  value 220k  PartNumber1: CRCW1206220KFKEAC  Power: 0.25W  Tolerance: 5%  [RES1206]  (hidden comment: Chip Resistor)
R?#47  value 220k  PartNumber1: CRCW1206220KFKEAC  Power: 0.25W  Tolerance: 5%  [RES1206]  (hidden comment: Chip Resistor)
R?#48  value 220k  PartNumber1: CRCW1206220KFKEAC  Power: 0.25W  Tolerance: 5%  [RES1206]  (hidden comment: Chip Resistor)

### Nets
GND: C?#36.2 C?#37.1 C?#38.2 C?#39.2 C?#40.1 C?#41.1 C?#42.2 R?#30.3 R?#32.1 R?#39.2
N5V0F: R?#37.1
P5V0F: R?#29.2
MEASM_LOW: C?#40.2 C?#41.2 C?#42.1 C?#46.2 R?#36.2 R?#38.1 R?#39.1 ; off-sheet MEASM_LOW
MEASP_LOW: C?#35.2 C?#36.1 C?#37.2 C?#38.1 R?#23.2 R?#24.1 R?#28.2 ; off-sheet MEASP_LOW
NetC?#23_1: C?#23.1 J?#3.1 R?#14.1
NetC?#23_2: C?#23.2 C?#24.1 R?#14.2 R?#15.1
NetC?#24_2: C?#24.2 C?#25.1 R?#15.2 R?#16.1
NetC?#25_2: C?#25.2 C?#26.1 R?#16.2 R?#17.1
NetC?#26_2: C?#26.2 C?#27.1 R?#17.2 R?#18.1
NetC?#27_2: C?#27.2 C?#28.1 R?#18.2 R?#19.1
NetC?#28_2: C?#28.2 C?#29.1 R?#19.2 R?#20.1
NetC?#29_2: C?#29.2 C?#30.1 R?#20.2 R?#21.1
NetC?#30_2: C?#30.2 C?#31.1 R?#21.2 R?#22.1
NetC?#31_2: C?#31.2 C?#32.1 R?#22.2 R?#25.1
NetC?#32_2: C?#32.2 C?#33.1 R?#25.2 R?#26.1
NetC?#33_2: C?#33.2 C?#34.1 R?#26.2 R?#27.1
NetC?#34_2: C?#34.2 C?#35.1 R?#27.2 R?#28.1
NetC?#39_1: C?#39.1 R?#24.2 R?#31.2
NetC?#43_1: C?#43.1 C?#55.2 R?#33.1 R?#48.2
NetC?#43_2: C?#43.2 C?#44.1 R?#33.2 R?#34.1
NetC?#44_2: C?#44.2 C?#45.1 R?#34.2 R?#35.1
NetC?#45_2: C?#45.2 C?#46.1 R?#35.2 R?#36.1
NetC?#47_1: C?#47.1 J?#4.1 R?#40.1
NetC?#47_2: C?#47.2 C?#48.1 R?#40.2 R?#41.1
NetC?#48_2: C?#48.2 C?#49.1 R?#41.2 R?#42.1
NetC?#49_2: C?#49.2 C?#50.1 R?#42.2 R?#43.1
NetC?#50_2: C?#50.2 C?#51.1 R?#43.2 R?#44.1
NetC?#51_2: C?#51.2 C?#52.1 R?#44.2 R?#45.1
NetC?#52_2: C?#52.2 C?#53.1 R?#45.2 R?#46.1
NetC?#53_2: C?#53.2 C?#54.1 R?#46.2 R?#47.1
NetC?#54_2: C?#54.2 C?#55.1 R?#47.2 R?#48.1
NetR?#23_1: R?#23.1 R?#30.1 R?#30.2
NetR?#29_1: R?#29.1 R?#31.1
NetR?#31_3: R?#31.3 R?#37.2
NetR?#32_2: R?#32.2 R?#32.3 R?#38.2

### Notes on the sheet
- Title
- Author
- Checked By
- Size:
- Revision:
- A3
- Date:
- Project
- Time:
- Sheet
- of
- File:

### Library data of the parts
C?#23-C?#35 C?#43-C?#55 = CC0805: as C?#4 on sheet HVP_BatteryCharger_v1.0; Published: 19-Jun-2016; LatestRevisionDate: 19-Jun-2016; Publisher: Lucas Moraes; PackageReference: CAP0805; PackageDescription: CAP0805;2 Leads
C?#36 C?#37 C?#39-C?#41 = CC0603: as C?#1 on sheet HVP_BatteryCharger_v1.0; Published: 19-Jun-2016; LatestRevisionDate: 19-Jun-2016; Publisher: Lucas Moraes; PackageReference: CAP0603; PackageDescription: CAP0603;2 Leads
C?#38 C?#42 = TrimmerBrown_70pF_100V: Trimmer / Variable Capacitors PP; Manufacter1: Tayda Electronics; Published: 10-May-2016; LatestRevisionDate: 10-May-2016; Publisher: Lucas Moraes; PackageReference: TrimmerBrown; PackageDescription: TrimmerBrown;2 Leads; Datasheet: *; PartNumber1: *
J?#3 J?#4 = Wire Connector 1.5mm2: Wire Connector 1.50mm2; Gender: Female; Published: 30-Agu-2018; LatestRevisionDate: 30-Agu-2018; PackageReference: WireConnector1.5mm2;1 pin; Publisher: Lucas Moraes; PackageDescription: WireConnecto1.5mm2; Type: Hole; Pins: 1
R?#14-R?#22 R?#25-R?#28 R?#33-R?#36 R?#40-R?#48 = CRCW1206: Thick Film Chip Resistors with CECC Approval,  available with Established Reliability; Manufacter1: Vishay / Dale; LatestRevisionDate: 06-May-2016; PackageReference: 1206; Publisher: Lucas Moraes; PackageDescription: SMD 1206; 2 Leads; Published: 06-May-2016
R?#23 R?#24 R?#29 R?#37-R?#39 = CRCW0603: as R?#1 on sheet HVP_BatteryCharger_v1.0; LatestRevisionDate: 06-May-2016; PackageReference: 0603; Publisher: Lucas Moraes; PackageDescription: SMD 0603; 2 Leads; Published: 06-May-2016
  R?#24 R?#29 R?#37 R?#39: PartNumber1: CRCW0603
R?#30-R?#32 = 3296W: Trimmer Resistors - Through Hole 3/8" 100Kohms Sealed Vertical Adjust; Manufacter1: Bourns; Published: 22-May-2017; LatestRevisionDate: 22-May-2017; PackageReference: 3296W; Publisher: Lucas Moraes; PackageDescription: 3386F; 3 Leads; PartNumber1: 3296W

## Sheet HVP_Amplifier_v1.0.SchDoc
size A3; Organization: SEW EURODRIVE; Address1: Jose Rubim Rd.; Address2: Santos Dumont Rd.; Address3: 205; Address4: Indaiatuba/SP; Address5: Brazil
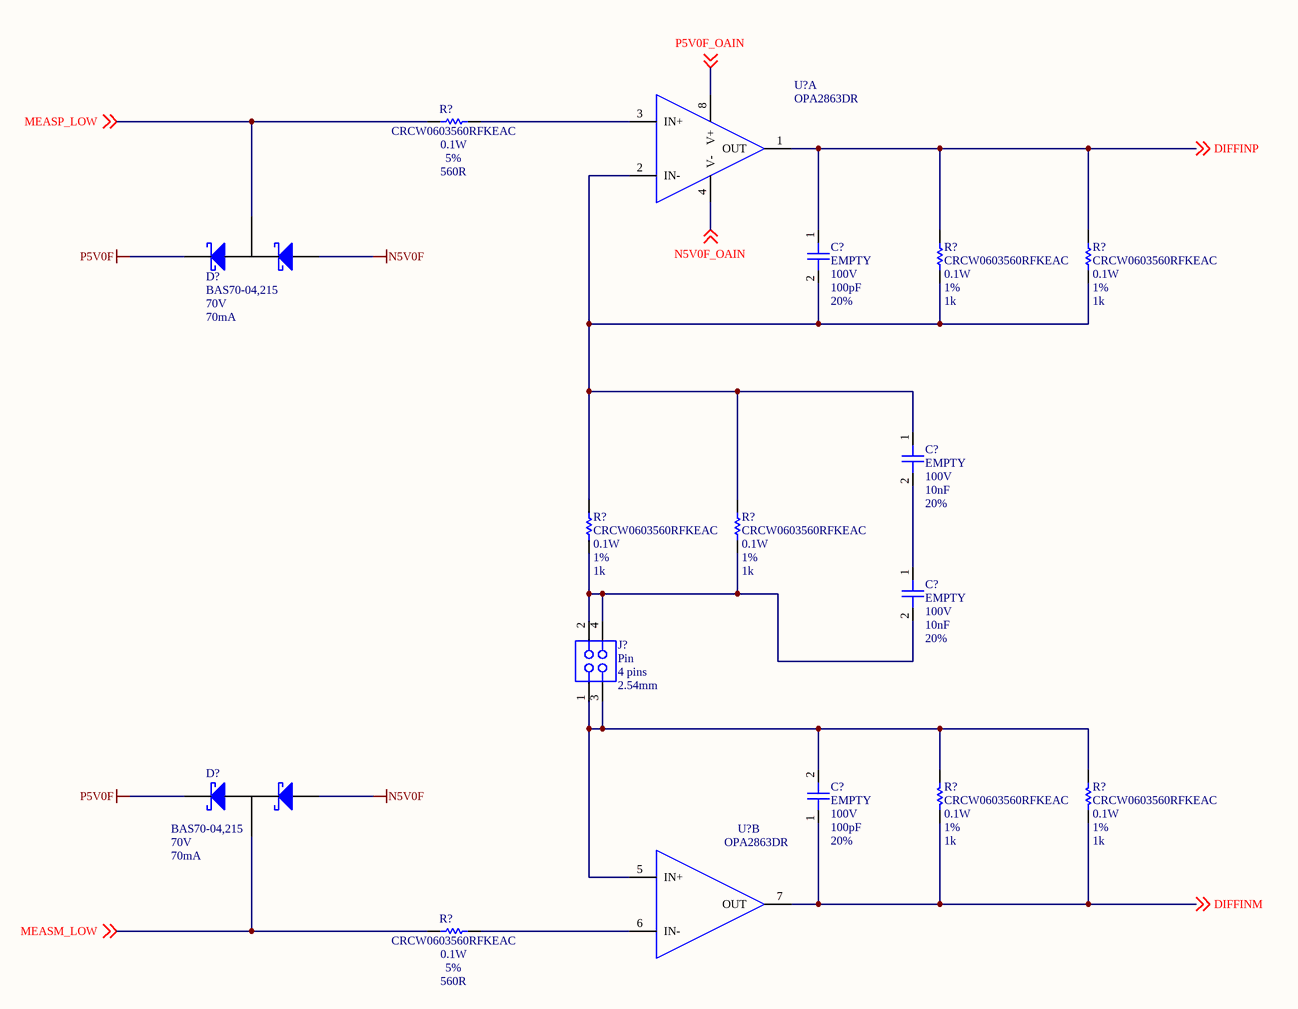
[diagram p4: HVP_Amplifier_v1.0.SchDoc]

### Parts
(Parts that share a designator on the sheet are numbered #1, #2 ... from top to bottom, then left to right.)
C?#56  value 100pF  PartNumber1: EMPTY  Voltage: 100V  Tolerance: 20%  [CAP0603]  (hidden comment: CC0603)
C?#57  value 10nF  PartNumber1: EMPTY  Voltage: 100V  Tolerance: 20%  [CAP0603]  (hidden comment: CC0603)
C?#58  value 10nF  PartNumber1: EMPTY  Voltage: 100V  Tolerance: 20%  [CAP0603]  (hidden comment: CC0603)
C?#59  value 100pF  PartNumber1: EMPTY  Voltage: 100V  Tolerance: 20%  [CAP0603]  (hidden comment: CC0603)
D?#2  Vrrm: 70V  If: 70mA  [SOT-23]  (hidden comment: BAS70-04,215)
D?#3  Vrrm: 70V  If: 70mA  [SOT-23]  (hidden comment: BAS70-04,215)
J?#5  Type: Pin  Pins: 4 pins  Pitch: 2.54mm  [CONDIL04STRMALE_100_100]  (hidden comment: 10-89-7042)
R?#49  value 560R  PartNumber1: CRCW0603560RFKEAC  Power: 0.1W  Tolerance: 5%  [RES0603]  (hidden comment: Chip Resistor)
R?#50  value 1k  PartNumber1: CRCW0603560RFKEAC  Power: 0.1W  Tolerance: 1%  [RES0603]  (hidden comment: Chip Resistor)
R?#51  value 1k  PartNumber1: CRCW0603560RFKEAC  Power: 0.1W  Tolerance: 1%  [RES0603]  (hidden comment: Chip Resistor)
R?#52  value 1k  PartNumber1: CRCW0603560RFKEAC  Power: 0.1W  Tolerance: 1%  [RES0603]  (hidden comment: Chip Resistor)
R?#53  value 1k  PartNumber1: CRCW0603560RFKEAC  Power: 0.1W  Tolerance: 1%  [RES0603]  (hidden comment: Chip Resistor)
R?#54  value 1k  PartNumber1: CRCW0603560RFKEAC  Power: 0.1W  Tolerance: 1%  [RES0603]  (hidden comment: Chip Resistor)
R?#55  value 1k  PartNumber1: CRCW0603560RFKEAC  Power: 0.1W  Tolerance: 1%  [RES0603]  (hidden comment: Chip Resistor)
R?#56  value 560R  PartNumber1: CRCW0603560RFKEAC  Power: 0.1W  Tolerance: 5%  [RES0603]  (hidden comment: Chip Resistor)
U?#5  OPA2863DR  [SOIC-8-3.9mm]  (part A of 2)
U?#6  OPA2863DR  [SOIC-8-3.9mm]  (part B of 2)

### Nets
N5V0F: D?#2.1(A1) D?#3.1(A1)
P5V0F: D?#2.2(K2) D?#3.2(K2)
DIFFINM: C?#59.1 R?#54.1 R?#55.1 U?#6.7(OUT) ; off-sheet DIFFINM
DIFFINP: C?#56.1 R?#50.1 R?#51.1 U?#5.1(OUT) ; off-sheet DIFFINP
MEASM_LOW: D?#3.3(K1A2) R?#56.2 ; off-sheet MEASM_LOW
MEASP_LOW: D?#2.3(K1A2) R?#49.2 ; off-sheet MEASP_LOW
N5V0F_OAIN: U?#5.4(V-) ; off-sheet N5V0F_OAIN
P5V0F_OAIN: U?#5.8(V+) ; off-sheet P5V0F_OAIN
NetC?#56_2: C?#56.2 C?#57.1 R?#50.2 R?#51.2 R?#52.1 R?#53.1 U?#5.2(IN-)
NetC?#57_2: C?#57.2 C?#58.1
NetC?#58_2: C?#58.2 J?#5.2 J?#5.4 R?#52.2 R?#53.2
NetC?#59_2: C?#59.2 J?#5.1 J?#5.3 R?#54.2 R?#55.2 U?#6.5(IN+)
NetR?#49_1: R?#49.1 U?#5.3(IN+)
NetR?#56_1: R?#56.1 U?#6.6(IN-)

### Notes on the sheet
- Title
- Author
- Checked By
- Size:
- Revision:
- A3
- Date:
- Project
- Time:
- Sheet
- of
- File:

### Library data of the parts
C?#56-C?#59 = CC0603: as C?#1 on sheet HVP_BatteryCharger_v1.0; Published: 19-Jun-2016; LatestRevisionDate: 19-Jun-2016; Publisher: Lucas Moraes; PackageReference: CAP0603; PackageDescription: CAP0603;2 Leads
D?#2 D?#3 = BAS70-04,215: Schottky Diodes & Rectifiers 70V 225mW Single; Manufacter1: Nexperia; Vf: 0.475V; Published: 19-Agu-2019; LatestRevisionDate: 19-Agu-2019; PackageReference: SOT-23; Publisher: Lucas Moraes; PackageDescription: SOT-23 ; 2 Leads; PartNumber1: BAS70-04,215
J?#5 = 10-89-7042: Headers & Wire Housings C-Grid PCB Conn SR V onn SR Vt Tn-A 4Ckt; Manufacter1: Molex; LastRevisionNote: Created; Gender: Male; Direction: 180; Published: 11-Sep-2017; LatestRevisionDate: 11-Sep-2017; PackageReference: CONDIL4; Publisher: Lucas Moraes; PackageDescription: CONDIL4; 4 Leads; PartNumber1: 10-89-7042
R?#49-R?#56 = CRCW0603: as R?#1 on sheet HVP_BatteryCharger_v1.0; LatestRevisionDate: 06-May-2016; PackageReference: 0603; Publisher: Lucas Moraes; PackageDescription: SMD 0603; 2 Leads; Published: 06-May-2016
U?#5 U?#6 = OPA2863DR: High Speed Operational Amplifiers Dual, low-power, 110-MHz, 12-V, rail-to-rail input and output (RRIO) voltage-feedback amplifier; Manufacter1: Texas Instruments; Power: 200mW; Published: 18-Apr-2023; LatestRevisionDate: 18-Apr-2023; LatestRevisionNote: Created; PackageReference: SOIC8; Publisher: Lucas Moraes; PackageDescription: SOIC8; 8 Leads; Datasheet: https://www.ti.com/lit/ds/symlink/opa863.pdf; PartNumber1: OPA2863DR

## Sheet HVP_DiffAmplifier_v1.0.SchDoc
size A3; Organization: SEW EURODRIVE; Address1: Jose Rubim Rd.; Address2: Santos Dumont Rd.; Address3: 205; Address4: Indaiatuba/SP; Address5: Brazil
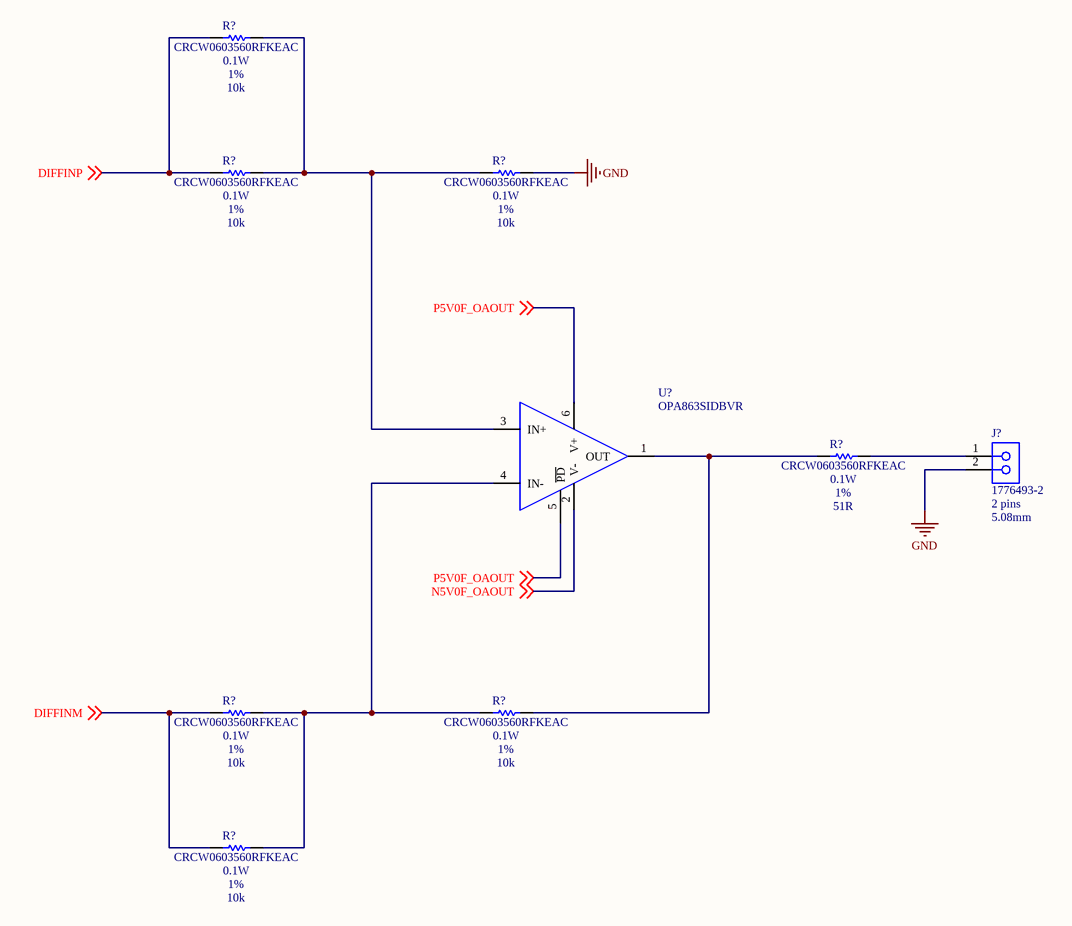
[diagram p5: HVP_DiffAmplifier_v1.0.SchDoc]

### Parts
(Parts that share a designator on the sheet are numbered #1, #2 ... from top to bottom, then left to right.)
J?#6  1776493-2  Pins: 2 pins  Pitch: 5.08mm  [PT 1,5/ 2-5,0-H]
R?#57  value 10k  PartNumber1: CRCW0603560RFKEAC  Power: 0.1W  Tolerance: 1%  [RES0603]  (hidden comment: Chip Resistor)
R?#58  value 10k  PartNumber1: CRCW0603560RFKEAC  Power: 0.1W  Tolerance: 1%  [RES0603]  (hidden comment: Chip Resistor)
R?#59  value 10k  PartNumber1: CRCW0603560RFKEAC  Power: 0.1W  Tolerance: 1%  [RES0603]  (hidden comment: Chip Resistor)
R?#60  value 51R  PartNumber1: CRCW0603560RFKEAC  Power: 0.1W  Tolerance: 1%  [RES0603]  (hidden comment: Chip Resistor)
R?#61  value 10k  PartNumber1: CRCW0603560RFKEAC  Power: 0.1W  Tolerance: 1%  [RES0603]  (hidden comment: Chip Resistor)
R?#62  value 10k  PartNumber1: CRCW0603560RFKEAC  Power: 0.1W  Tolerance: 1%  [RES0603]  (hidden comment: Chip Resistor)
R?#63  value 10k  PartNumber1: CRCW0603560RFKEAC  Power: 0.1W  Tolerance: 1%  [RES0603]  (hidden comment: Chip Resistor)
U?#7  OPA863SIDBVR  [SOT23-6]

### Nets
GND: J?#6.2 R?#59.1
DIFFINM: R?#61.2 R?#63.2 ; off-sheet DIFFINM
DIFFINP: R?#57.2 R?#58.2 ; off-sheet DIFFINP
N5V0F_OAOUT: U?#7.2(V-) ; off-sheet N5V0F_OAOUT
P5V0F_OAOUT: U?#7.5(~{PD}) U?#7.6(V+) ; off-sheet P5V0F_OAOUT
NetJ?#6_1: J?#6.1 R?#60.1
NetR?#57_1: R?#57.1 R?#58.1 R?#59.2 U?#7.3(IN+)
NetR?#60_2: R?#60.2 R?#62.1 U?#7.1(OUT)
NetR?#61_1: R?#61.1 R?#62.2 R?#63.1 U?#7.4(IN-)

### Notes on the sheet
- Title
- Author
- Checked By
- Size:
- Revision:
- A3
- Date:
- Project
- Time:
- Sheet
- of
- File:

### Library data of the parts
J?#6 = 1776493-2: Fixed Terminal Blocks SIDE WIRE ENTRY TB 5.08MM BL; Manufacter1: TE Connectivity; Published: 31-Jul-2017; LatestRevisionDate: 31-Jul-2017; PackageReference: 1776493-2; Publisher: Lucas Moraes; PackageDescription: 1776493-2; 2 Leads; Type: Fixed Terminal Blocks; PartNumber1: 1776493-2; Color: Blue
R?#57-R?#63 = CRCW0603: as R?#1 on sheet HVP_BatteryCharger_v1.0; LatestRevisionDate: 06-May-2016; PackageReference: 0603; Publisher: Lucas Moraes; PackageDescription: SMD 0603; 2 Leads; Published: 06-May-2016
U?#7 = OPA863SIDBVR: High Speed Operational Amplifiers Dual, low-power, 110-MHz, 12-V, rail-to-rail input and output (RRIO) voltage-feedback amplifier; Manufacter1: Texas Instruments; Power: 200mW; Published: 18-Apr-2023; LatestRevisionDate: 18-Apr-2023; LatestRevisionNote: Created; PackageReference: SOIC8; Publisher: Lucas Moraes; PackageDescription: SOIC8; 8 Leads; Datasheet: https://www.ti.com/lit/ds/symlink/opa863.pdf; PartNumber1: OPA863SIDBVR

## Nets that join several sheets
GND: HVP_BatteryCharger_v1.0 (8 pins), HVP_PowerSupply_v1.0 (13 pins), HVP_PowerSupplyOpAmp_v1.0 (12 pins), HVP_InputDivisor_v1.0 (10 pins), HVP_DiffAmplifier_v1.0 (J?#6.2 R?#59.1)
N5V0F: HVP_PowerSupply_v1.0 (CE?#2.2 L?#5.2 LD?#4.K), HVP_PowerSupplyOpAmp_v1.0 (L?#7.1 L?#9.1), HVP_InputDivisor_v1.0 (R?#37.1), HVP_Amplifier_v1.0 (D?#2.1 D?#3.1)
P5V0F: HVP_PowerSupply_v1.0 (CE?#1.1 L?#3.2 LD?#3.A), HVP_PowerSupplyOpAmp_v1.0 (L?#6.1 L?#8.1), HVP_InputDivisor_v1.0 (R?#29.2), HVP_Amplifier_v1.0 (D?#2.2 D?#3.2)
P5V0M: HVP_BatteryCharger_v1.0 (LD?#1.A LD?#2.A), HVP_PowerSupply_v1.0 (C?#5.1 D?#1.K L?#3.1 R?#6.2)
PBAT: HVP_BatteryCharger_v1.0 (C?#4.1 J?#1.1 R?#1.1 U?#2.5), HVP_PowerSupply_v1.0 (J?#2.1)
DIFFINM: HVP_Amplifier_v1.0 (C?#59.1 R?#54.1 R?#55.1 U?#6.7), HVP_DiffAmplifier_v1.0 (R?#61.2 R?#63.2)
DIFFINP: HVP_Amplifier_v1.0 (C?#56.1 R?#50.1 R?#51.1 U?#5.1), HVP_DiffAmplifier_v1.0 (R?#57.2 R?#58.2)
MEASM_LOW: HVP_InputDivisor_v1.0 (7 pins), HVP_Amplifier_v1.0 (D?#3.3 R?#56.2)
MEASP_LOW: HVP_InputDivisor_v1.0 (7 pins), HVP_Amplifier_v1.0 (D?#2.3 R?#49.2)
N5V0F_OAIN: HVP_PowerSupplyOpAmp_v1.0 (C?#14.1 C?#15.1 C?#16.1 L?#7.2), HVP_Amplifier_v1.0 (U?#5.4)
N5V0F_OAOUT: HVP_PowerSupplyOpAmp_v1.0 (C?#20.1 C?#21.1 C?#22.1 L?#9.2), HVP_DiffAmplifier_v1.0 (U?#7.2)
P5V0F_OAIN: HVP_PowerSupplyOpAmp_v1.0 (C?#11.1 C?#12.1 C?#13.1 L?#6.2), HVP_Amplifier_v1.0 (U?#5.8)
P5V0F_OAOUT: HVP_PowerSupplyOpAmp_v1.0 (C?#17.1 C?#18.1 C?#19.1 L?#8.2), HVP_DiffAmplifier_v1.0 (U?#7.5 U?#7.6)